# Altium schematic sheet Wacky_Racers_extras.SchDoc: Wacky2023_Racer G24
size A3; DrawnBy: John Elliott, David Yin, Jamie Thomas, Jonny Smith; Address1: ECE Department; Address2: University of Canterbury; Address3: Christchurch 8041; Address4: New Zealand; Revision: 1; ImagePath: \\maxwell\elecapp\AltiumDesigner\Templates\uc-logo.png
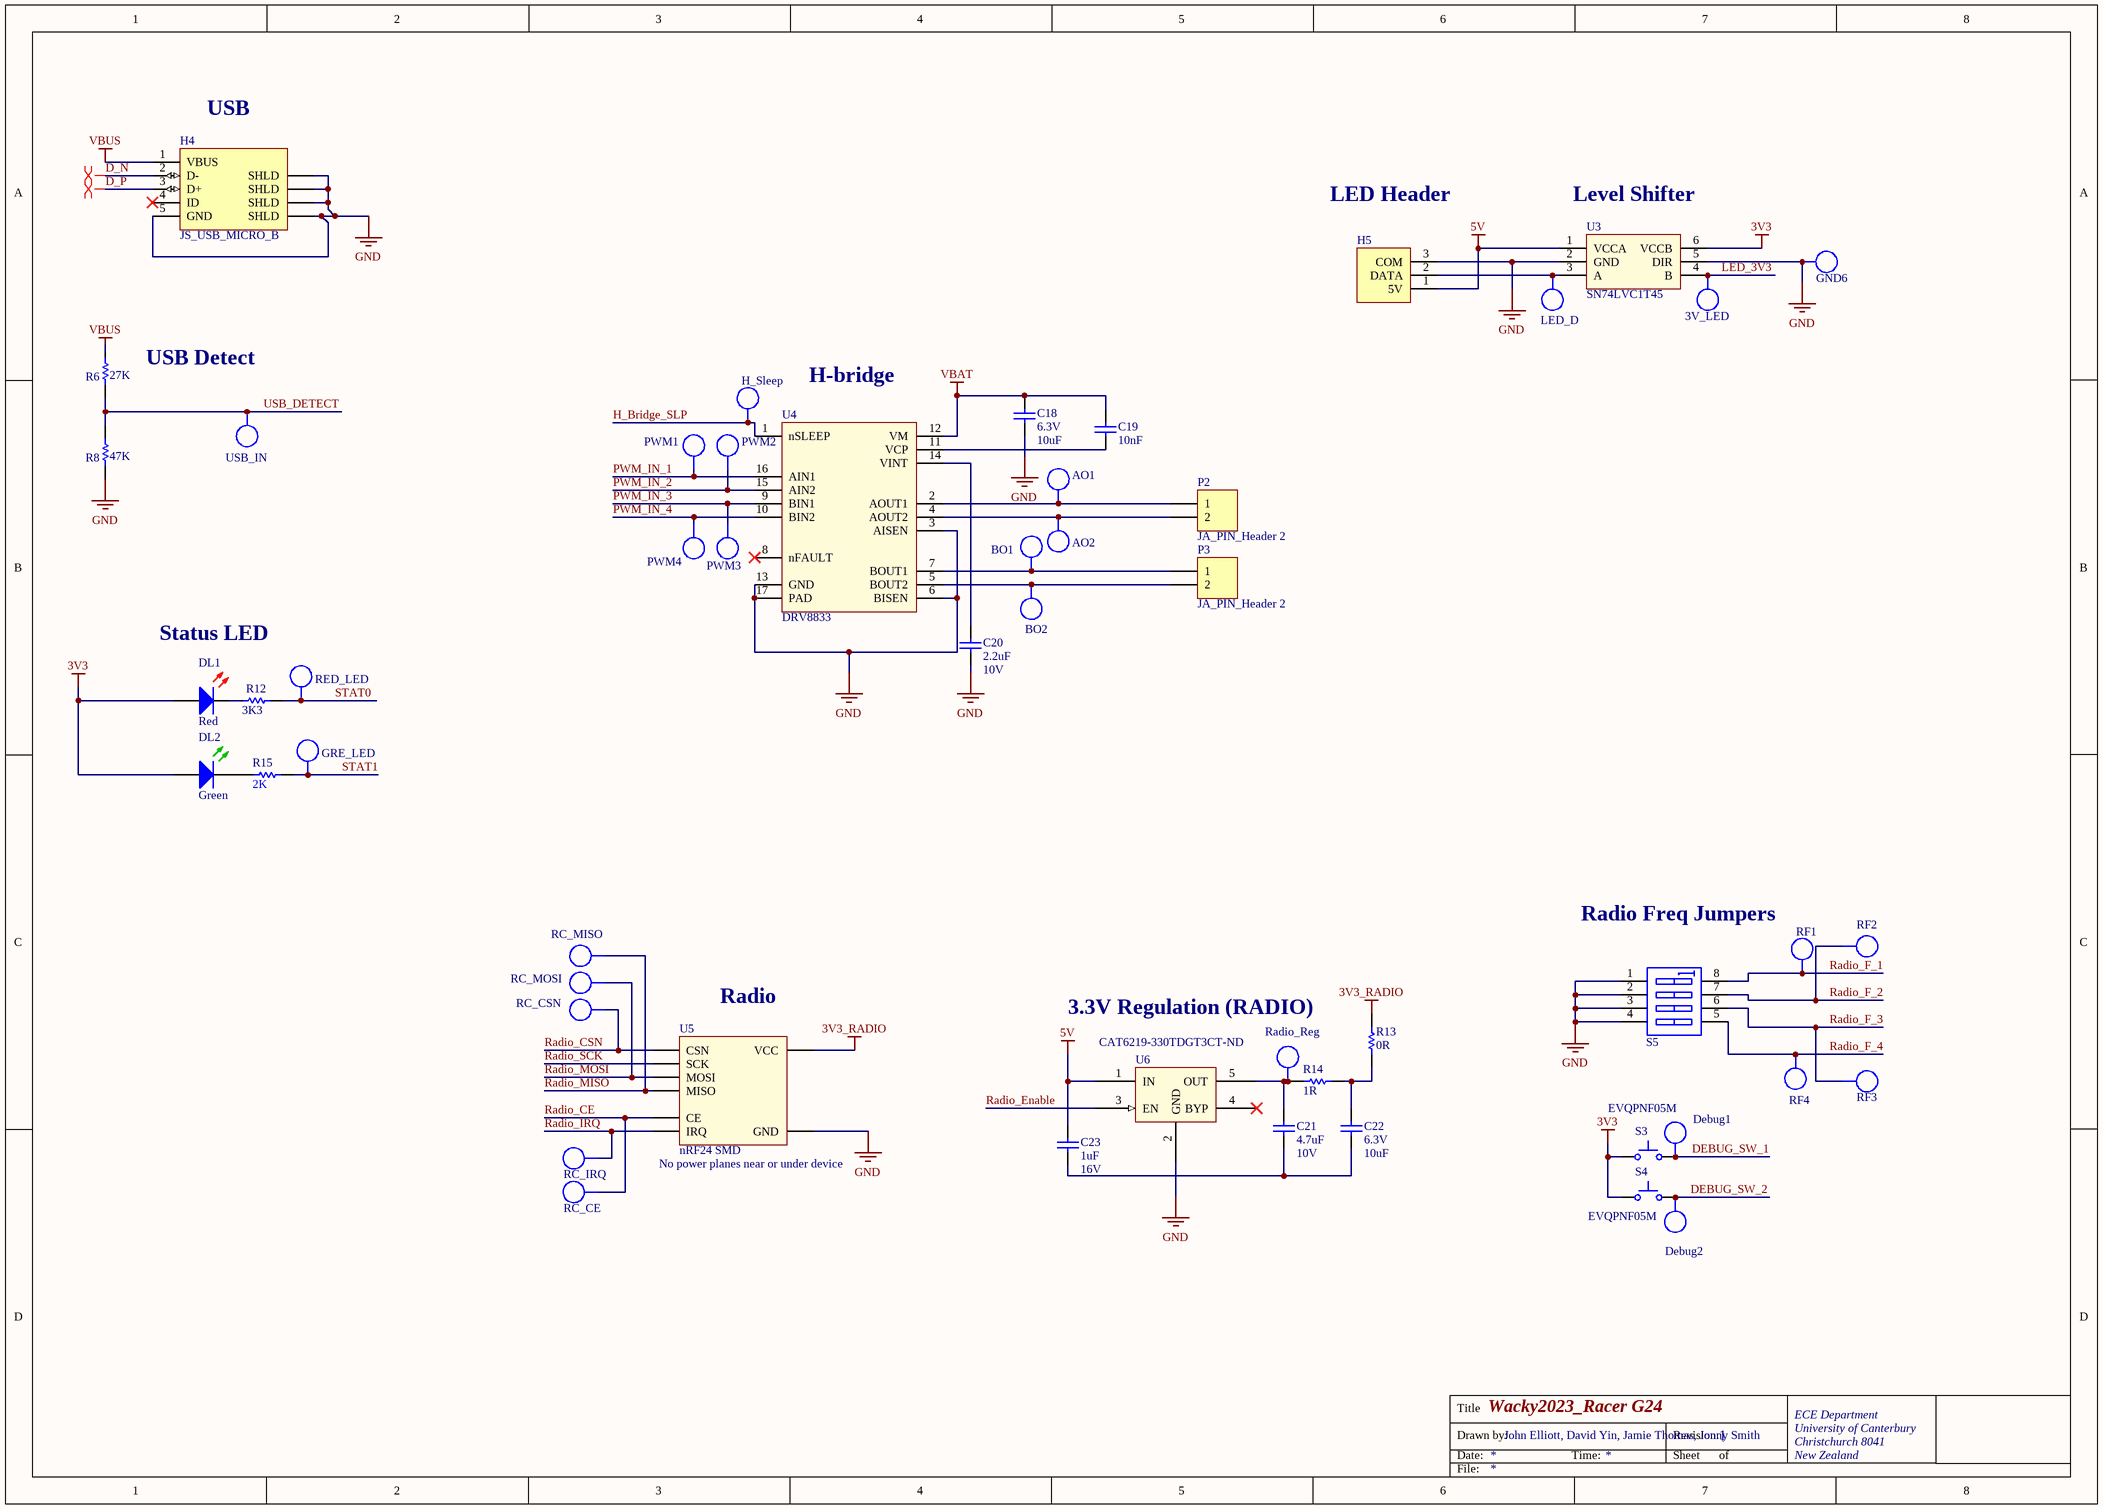
[diagram p0: Wacky_Racers_extras.SchDoc]

## Parts
3V_LED  TP  [TP_1206]  (value not drawn)  (no BOM)
AO1  TP  [TP_1206]  (value not drawn)  (no BOM)
AO2  TP  [TP_1206]  (value not drawn)  (no BOM)
BO1  TP  [TP_1206]  (value not drawn)  (no BOM)
BO2  TP  [TP_1206]  (value not drawn)  (no BOM)
C18  Voltage - Rated: 6.3V  [CAPC1608L]  (hidden comment: 10uF)
C19  10nF  [CAPC1608L]
C20  Max Voltage: 10V  [CAPC1608L]  (hidden comment: 2.2uF)
C21  Max Voltage: 10V  [CAPC1608N]  (hidden comment: 4.7uF)
C22  Voltage - Rated: 6.3V  [CAPC1608L]  (hidden comment: 10uF)
C23  Max Voltage: 16V  [CAPC1608L]  (hidden comment: 1uF)
Debug1  TP  [TP_1206]  (value not drawn)  (no BOM)
Debug2  TP  [TP_1206]  (value not drawn)  (no BOM)
DL1  Red  [WL-SMCW0603]
DL2  Green  [WL-SMCW0603]
GND6  TP  [TP_1206]  (value not drawn)  (no BOM)
GRE_LED  TP  [TP_1206]  (value not drawn)  (no BOM)
H4  JS_USB_MICRO_B  [FCI_USB_10118194-0001LF]
H5  3 Pin Molex KK Hdr  [MOLEX_KK_3_HDR]  (value not drawn)
H_Sleep  TP  [TP_1206]  (value not drawn)  (no BOM)
LED_D  TP  [TP_1206]  (value not drawn)  (no BOM)
P2  JA_PIN_Header 2  [HDR1X2]
P3  JA_PIN_Header 2  [HDR1X2]
PWM1  TP  [TP_1206]  (value not drawn)  (no BOM)
PWM2  TP  [TP_1206]  (value not drawn)  (no BOM)
PWM3  TP  [TP_1206]  (value not drawn)  (no BOM)
PWM4  TP  [TP_1206]  (value not drawn)  (no BOM)
R6  27K  [RESC1608L]
R8  47K  [RESC1608N]
R12  3K3  [RESC1608L]
R13  0R  [RESC1608L]
R14  1R  [RESC3216L]
R15  2K  [RESC1608L]
Radio_Reg  TP  [TP_1206]  (value not drawn)  (no BOM)
RC_CE  TP  [TP_1206]  (value not drawn)  (no BOM)
RC_CSN  TP  [TP_1206]  (value not drawn)  (no BOM)
RC_IRQ  TP  [TP_1206]  (value not drawn)  (no BOM)
RC_MISO  TP  [TP_1206]  (value not drawn)  (no BOM)
RC_MOSI  TP  [TP_1206]  (value not drawn)  (no BOM)
RED_LED  TP  [TP_1206]  (value not drawn)  (no BOM)
RF1  TP  [TP_1206]  (value not drawn)  (no BOM)
RF2  TP  [TP_1206]  (value not drawn)  (no BOM)
RF3  TP  [TP_1206]  (value not drawn)  (no BOM)
RF4  TP  [TP_1206]  (value not drawn)  (no BOM)
S3  EVQPNF05M  [EVQPNF05M]
S4  EVQPNF05M  [EVQPNF05M]
S5  WS_SW DIP-4  [DIP_SW_4WAY_SMD -]  (value not drawn)
U3  SN74LVC1T45  [SOT23-6_N]
U4  DRV8833  [HTSOP16 DRV8833]
U5  nRF24 SMD  Warning: No power planes near or under device  [NRF24]
U6  Supplier Part Number: CAT6219-330TDGT3CT-ND  [SOT95P280X145-5N]  (hidden comment: CAT6219-330TDGT3)
USB_IN  TP  [TP_1206]  (value not drawn)  (no BOM)

## Nets
3V3: DL1.2(A) DL2.2(A) S3.1 S4.1 U3.6(VCCB)
3V3_RADIO: R13.2 U5.1(VCC)
5V: C23.2 H5.1(5V) U3.1(VCCA) U6.1(IN)
GND: C18.1 C20.1 GND6.1 H4.5(GND) H4.6(SHLD) H5.3(COM) R8.1 S5.1(A1) S5.2(A2) S5.3(A3) S5.4(A4) U3.2(GND) U3.5(DIR) U4.3(AISEN) U4.6(BISEN) U4.13(GND) U4.17(PAD) U5.2(GND) U6.2(GND)
VBAT: C18.2 C19.2 U4.12(VM)
VBUS: H4.1(VBUS) R6.2
D_N: H4.2(D-)
D_P: H4.3(D+)
DEBUG_SW_1: Debug1.1 S3.2
DEBUG_SW_2: Debug2.1 S4.2
H_Bridge_SLP: H_Sleep.1 U4.1(nSLEEP)
LED_3V3: 3V_LED.1 U3.4(B)
PWM_IN_1: PWM1.1 U4.16(AIN1)
PWM_IN_2: PWM2.1 U4.15(AIN2)
PWM_IN_3: PWM3.1 U4.9(BIN1)
PWM_IN_4: PWM4.1 U4.10(BIN2)
Radio_CE: RC_CE.1 U5.3(CE)
Radio_CSN: RC_CSN.1 U5.4(CSN)
Radio_Enable: U6.3(EN)
Radio_F_1: RF1.1 S5.8(B1)
Radio_F_2: RF2.1 S5.7(B2)
Radio_F_3: RF3.1 S5.6(B3)
Radio_F_4: RF4.1 S5.5(B4)
Radio_IRQ: RC_IRQ.1 U5.8(IRQ)
Radio_MISO: RC_MISO.1 U5.7(MISO)
Radio_MOSI: RC_MOSI.1 U5.6(MOSI)
Radio_SCK: U5.5(SCK)
STAT0: R12.2 RED_LED.1
STAT1: GRE_LED.1 R15.2
USB_DETECT: R6.1 R8.2 USB_IN.1
NetAO1_1: AO1.1 P2.1 U4.2(AOUT1)
NetAO2_1: AO2.1 P2.2 U4.4(AOUT2)
NetBO1_1: BO1.1 P3.1 U4.7(BOUT1)
NetBO2_1: BO2.1 P3.2 U4.5(BOUT2)
NetC19_1: C19.1 U4.11(VCP)
NetC20_2: C20.2 U4.14(VINT)
NetC21_1: C21.1 C22.1 C23.1
NetC21_2: C21.2 R14.1 Radio_Reg.1 U6.5(OUT)
NetC22_2: C22.2 R13.1 R14.2
NetDL1_1: DL1.1(K) R12.1
NetDL2_1: DL2.1(K) R15.1
NetH5_2: H5.2(DATA) LED_D.1 U3.3(A)

Not connected (* = marked no-connect by the designer): H4 4(ID)*; U4 8(nFAULT)*; U6 4(BYP)*

## Layout directives
differential pair: D_N, D_P

## Notes on the sheet
- (near H4) USB
- LED Header
- (near U3) Level Shifter
- USB Detect
- H-bridge
- Status LED
- Radio Freq Jumpers
- (near U5) Radio
- 3.3V Regulation (RADIO)
- Title
- Drawn by:
- Date:
- Time:
- Revision:
- Sheet
- of
- File:

## Library data of the parts
3V_LED AO1 AO2 BO1 BO2 Debug1 Debug2 GND6 GRE_LED H_Sleep LED_D PWM1-PWM4 Radio_Reg RC_CE RC_CSN RC_IRQ RC_MISO RC_MOSI RED_LED RF1-RF4 USB_IN = TP_1206: Test-Point 3.3x1.6x2.1mm SMD; Manufacturer: Harwin Inc; Manufacturer Part Number: S1751-46R; Supplier 1: Digi-Key; Mounting Type: Surface Mount; Type: PC Test Point; Supplier Part Number 1: 952-1478-2-ND; Manufacturer PN: *; Storage Location: ProtoPlace; Supplier 2: Farnell; Supplier Part Number 2: 1826282; Supplier: ECE Dept; Value: TP
C18 C22 = CC_10uF_0603: CAP CER 10UF X5R +-20% 6V3 0603; Supplier: ECE Dept; Storage Location: PCB Assembly WS; Value: 10uF
C19 = CC_10nF_0603: CAP CER 10nF X7R +-10% 50V 0603; PackageReference: 0603; Code_IPC: 1608 [0603]; Verify: *; Supplier: ECE Dept; Storage Location: PCB Assembly WS; Value: 10nF
C20 = CC_2.2uF_0603: CAP CER 2.2uF X5R +-20% 10V 0603; PackageReference: 0603; Code_IPC: 1608 [0603]; Verify: *; Supplier: ECE Dept; Storage Location: PCB Assembly WS; Value: 2.2uF
C21 = CC_4.7uF_0603: CAP CER 4.7uF X5R +-20%  10V 0603; Note: Footprint corresponds to dimensions for bulk cassette packaging. This case size has tightened tolerances.; PackageReference: 0805; Code_IPC: 2012[0805]; Verify: *; Supplier: ECE Dept; Storage Location: PCB Assembly WS; Value: 4.7uF
C23 = CC_1uF_0603: CAP CER 1uF Y5V -20% +80% 16V 0603; PackageReference: 0603; Code_IPC: 1608 [0603]; Verify: *; Supplier: ECE Dept; Storage Location: PCB Assembly WS; Value: 1uF
DL1 = DL_150060RS75000: LED Red 250mcd 0603 SMD; Manufacturer: WURTH ELEKTRONIK; Forward Current If: 30; Forward Voltage: 2; Lens Shape: Rectangular; Luminous Intensity: 250; Wavelength Typ: 625; Viewing Angle: 140°; LED Mounting: SMD; Supplier 1: Farnell; Supplier Part Number 1: 2322071; Manufacturer Part Number: 150060RS75000; Storage Location: PCB Assembly WS; Supplier: ECE Dept; LED Colour: Red
DL2 = DL_150060GS75000: LED Green 430mcd 0603 SMD; Manufacturer: WURTH ELEKTRONIK; Forward Current If: 30; Wavelength Typ: 520; Forward Voltage: 3.2; Lens Shape: Rectangular; Luminous Intensity: 430; Viewing Angle: 140°; LED Mounting: SMD; Supplier 1: Farnell; Supplier Part Number 1: 2322070; Manufacturer Part Number: 150060GS75000; Storage Location: PCB Assembly WS; Supplier: ECE Dept; LED Colour: Green
H4 = JS_USB_MICRO_B_SMT: CONN USB MICRO B RECPT SMT R/A; Manufacturer: FCI; Manufacturer Part Number: 10118194-0001LF; Gender: Receptacle; Number of Contacts: 5; Specifications: USB 2.0; Supplier 1: Digi-Key; Supplier Part Number 1: 609-4618-1-ND; Features: Shielded, Solder Retention; Mounting Type: Surface Mount, Right Angle, Horizontal
H5 = LED_Strip_Header: CONN HEADER 3POS 2.54mm VERT_Thru Hole; Manufacturer: Molex; Manufacturer PN: 22-23-2031; Supplier Part Number 1: 9731156; Supplier: ECE Dept; Supplier 1: Farnell; Storage Location: ECE Dept Store; Value: 3 Pin Molex KK Hdr
P2 P3 = JA_PIN_Header 2: Header, 2-Pin; LatestRevisionDate: 17-Jul-2002; LatestRevisionNote: Re-released for DXP Platform.; Publisher: Altium Limited
R6 = RS_27K: RES 27K OHM 1/10W 5% 0603 SMD; Storage Location: PCB Assembly WS; Supplier: ECE Dept; Value: 27K
R8 = RS_47K: RES 47.0K OHM 1/10W 5% 0603 SMD; Storage Location: PCB Assembly WS; Supplier: ECE Dept; Value: 47K
R12 = RS_3K3: RES 3.3K OHM 1/10W 5% 0603 SMD; Storage Location: PCB Assembly WS; Supplier: ECE Dept; Value: 3K3
R13 = RS_0R0: RES 0.0 OHM 1/10W 5% 0603 SMD; Storage Location: PCB Assembly WS; Supplier: ECE Dept; Value: 0R
R14 = RT_1R: RES 1R OHM 1/4W 5% 1206 SMD; Storage Location: PCB Assembly WS; Supplier: ECE Dept; Value: 1R
R15 = RS_2K: RES 2K OHM 1/10W 5% 0603 SMD; Storage Location: PCB Assembly WS; Supplier: ECE Dept; Value: 2K
S3 S4 = WS_EVQPNF05M: Panasonic 6 x 3.5mm SMD Light Touch Switch Type SMD; PackageDescription: 6.0 x 3.5 mm; Supplier 1: Farnell; Supplier Part Number 1: 2079481; Manufacturer: Panasonic; Manufacturer PN: EVQPNF05M; Supplier 2: Digi-Key; Supplier Part Number 2: P13598SCT-ND; Storage Location: PCB Assembly WS; Supplier: ECE Dept
S5 = WS_SW DIP-4: DIP Switch, 4 Position, SPST SMD; Manufacturer: OMRON ELECTRONIC COMPONENTS; Manufacturer Part Number: A6SN-4101; Contact Current DC Max: 25; External Length / Height: 12.1; No. of Switch Positions: 4; Pitch Spacing: 2.54; Contact Configuration: SPST; Supplier 1: Farnell; Supplier Part Number 1: 2029425; Storage Location: PCB Assembly WS; Supplier: ECE Dept
U3 = SN74LVC1T45: 1.8V - 5V level converter
U4 = DRV8833: Dual H-Bridge Motor Driver 1.5A; ComponentLink1Description: DRV8833 Datasheet; ComponentLink1URL: \\maxwell\elecapp\AltiumDesigner\Libraries\DatasheetsNew\ENCE461\drv8833pwpr.pdf
U5 = NRF24: nRF24 SMD Module
U6 = SV_CAT6219-330TDGT3: IC REG LIN 3.3V 500MA TSOT23-5; Voltage - Input (Max): 5.5V; Voltage Dropout (Max): 0.5V @ 500mA; Manufacturer Part Number: CAT6219-330TDGT3; Base Part Number: CAT6219; Current - Output: 500mA; Package / Case: SOT-23-5 Thin, TSOT-23-5; Supplier: Digi-Key; Supplier Device Package: TSOT-23-5; Voltage - Output (Min/Fixed): 3.3V; ComponentLink1URL: http://www.onsemi.com/pub/Collateral/CAT6219-D.PDF; ComponentLink1Description: http://www.onsemi.com/pub/Collateral/CAT6219-D.PDF; Supplier 1: Digi-Key; ComponentLink2Description: CAT6219 Datasheet; ComponentLink2URL: \\maxwell\elecapp\AltiumDesigner\Libraries\DatasheetsNew\ENCE461\CAT6219-D.PDF